# Altium schematic sheet APD9328_ANALOG.SchDoc: ANALOG
size A4; Author: NC; Revision: 1.0; SheetNumber: 11; SheetTotal: 14
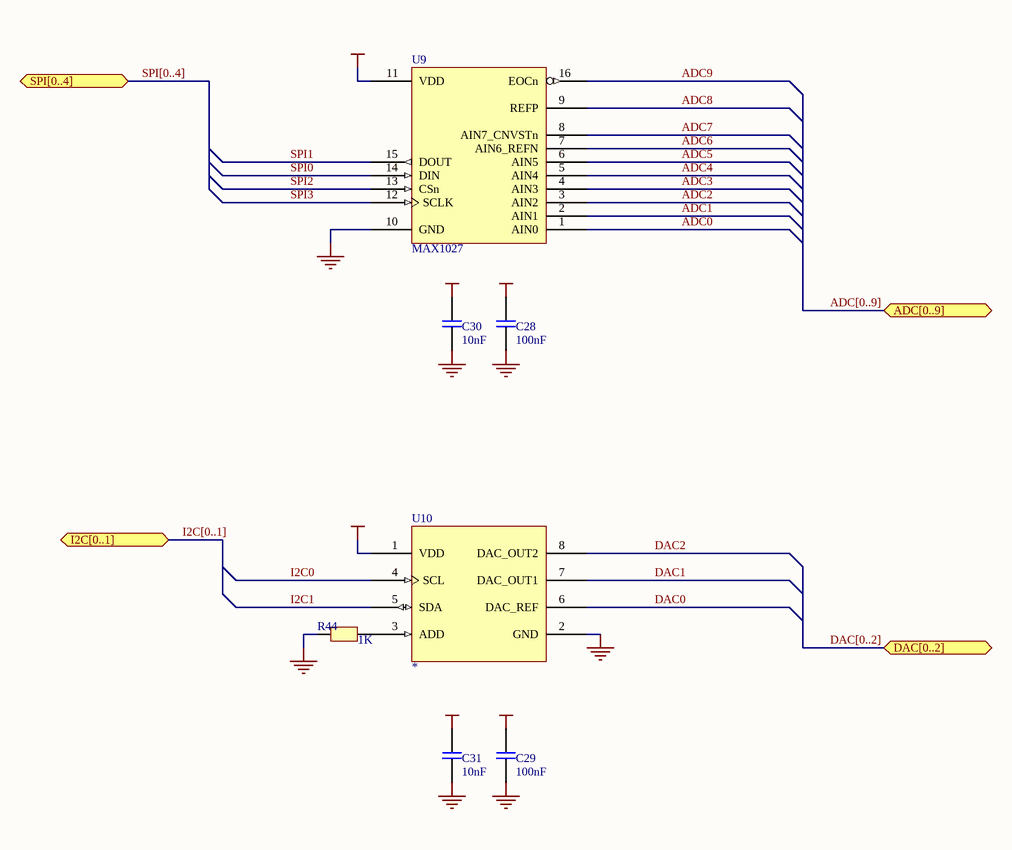
[diagram p0: APD9328_ANALOG.SchDoc]

## Parts
C28  100nF  [0402]
C29  100nF  [0402]
C30  10nF  [0402]
C31  10nF  [0402]
R44  1K  [0402]
U9  MAX1027  [QSOP16]
U10  *

## Ports
ADC[0..9] (bidir), DAC[0..2] (bidir), I2C[0..1] (bidir), SPI[0..4] (bidir)

## Nets
+3V3: C28.2 C29.2 C30.2 C31.2 U9.11(VDD) U10.1(VDD)
GND: C28.1 C29.1 C30.1 C31.1 R44.1 U9.10(GND) U10.2(GND)
ADC0: U9.1(AIN0)
ADC1: U9.2(AIN1)
ADC2: U9.3(AIN2)
ADC3: U9.4(AIN3)
ADC4: U9.5(AIN4)
ADC5: U9.6(AIN5)
ADC6: U9.7(AIN6_REFN)
ADC7: U9.8(AIN7_CNVSTn)
ADC8: U9.9(REFP)
ADC9: U9.16(EOCn)
DAC0: U10.6(DAC_REF)
DAC1: U10.7(DAC_OUT1)
DAC2: U10.8(DAC_OUT2)
I2C0: U10.4(SCL)
I2C1: U10.5(SDA)
SPI0: U9.14(DIN)
SPI1: U9.15(DOUT)
SPI2: U9.13(CSn)
SPI3: U9.12(SCLK)
NetR44_2: R44.2 U10.3(ADD)

## Buses and harness runs
bus ADC[0..9] = port ADC[0..9]
bus DAC[0..2] = port DAC[0..2]
bus I2C[0..1] = port I2C[0..1]
bus SPI[0..4] = port SPI[0..4]

## Notes on the sheet
- Title
- Size:
- Date:
- A4
- Author:
- Revision:
- Sheet
- of
- Armadeus Embedded Solutions
- File:

## Library data of the parts
C28-C31 = Cap: Assembly Option: A
R44 = Res: Assembly Option: A
U9 = MAX1027: ADC serial converter; Manufacturer: Maxim; Part Number: MAX1027-BCCE; Assembly Option: A; Distributor: Maxim; Price_100: 4,25; Price_500: 3,83; Price_1000: 3,46
U10 = MAX5821